# Altium project DC-DC Buck Conv.PrjPcb
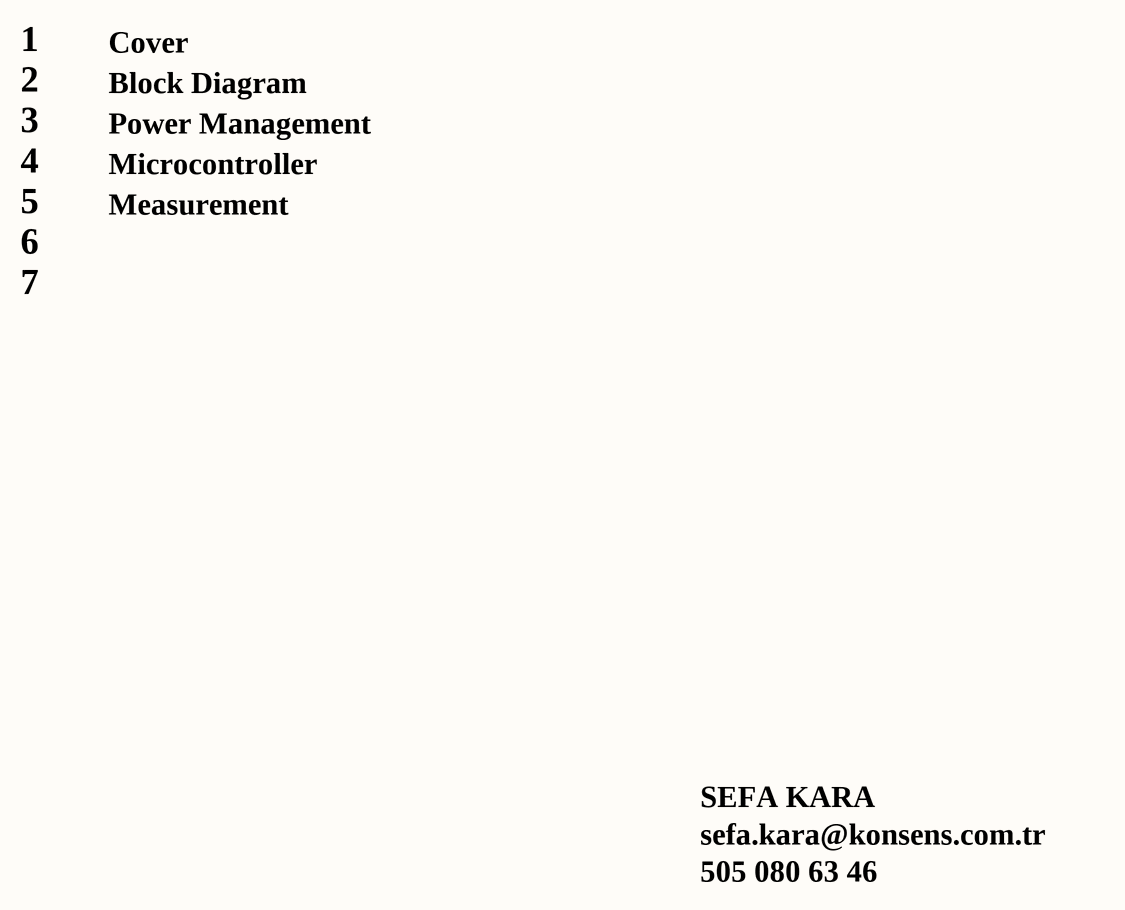
[diagram p0: Cover.SchDoc]
4 sheets, 39 parts. Net scope: global (net labels, ports and power ports of the same name join across sheets).
Board file: DC-DCBuckConv.PcbDoc
Sheets:
  Cover.SchDoc
  BlockDiagram.SchDoc
  Power.SchDoc
  Mcu.SchDoc

## Sheet Cover.SchDoc
size A3; SheetNumber: 1; SheetTotal: 3

### Notes on the sheet
- 1
- 2
- Cover
- Block Diagram
- 3
- Power Management
- 4
- 5
- Microcontroller
- Measurement
- 6
- 7
- SEFA KARA
- sefa.kara@konsens.com.tr
- 505 080 63 46
- CONTENTS
- REVISION
- PRODUCTION NOTES
- Page No
- Description
- Date
- BOARD
- PROPERTIES
- GERBER
- FILES
- APPENDICES
- CONTACT
- Company Name
- Engineer
- PROJECT
- Rel Date
- FILE NAME
- Checked By
- Approved By
- Rev Date
- Change Date
- Department
- Revision
- Sheet
- of

## Sheet BlockDiagram.SchDoc
size A4; SheetNumber: 2; SheetTotal: 5
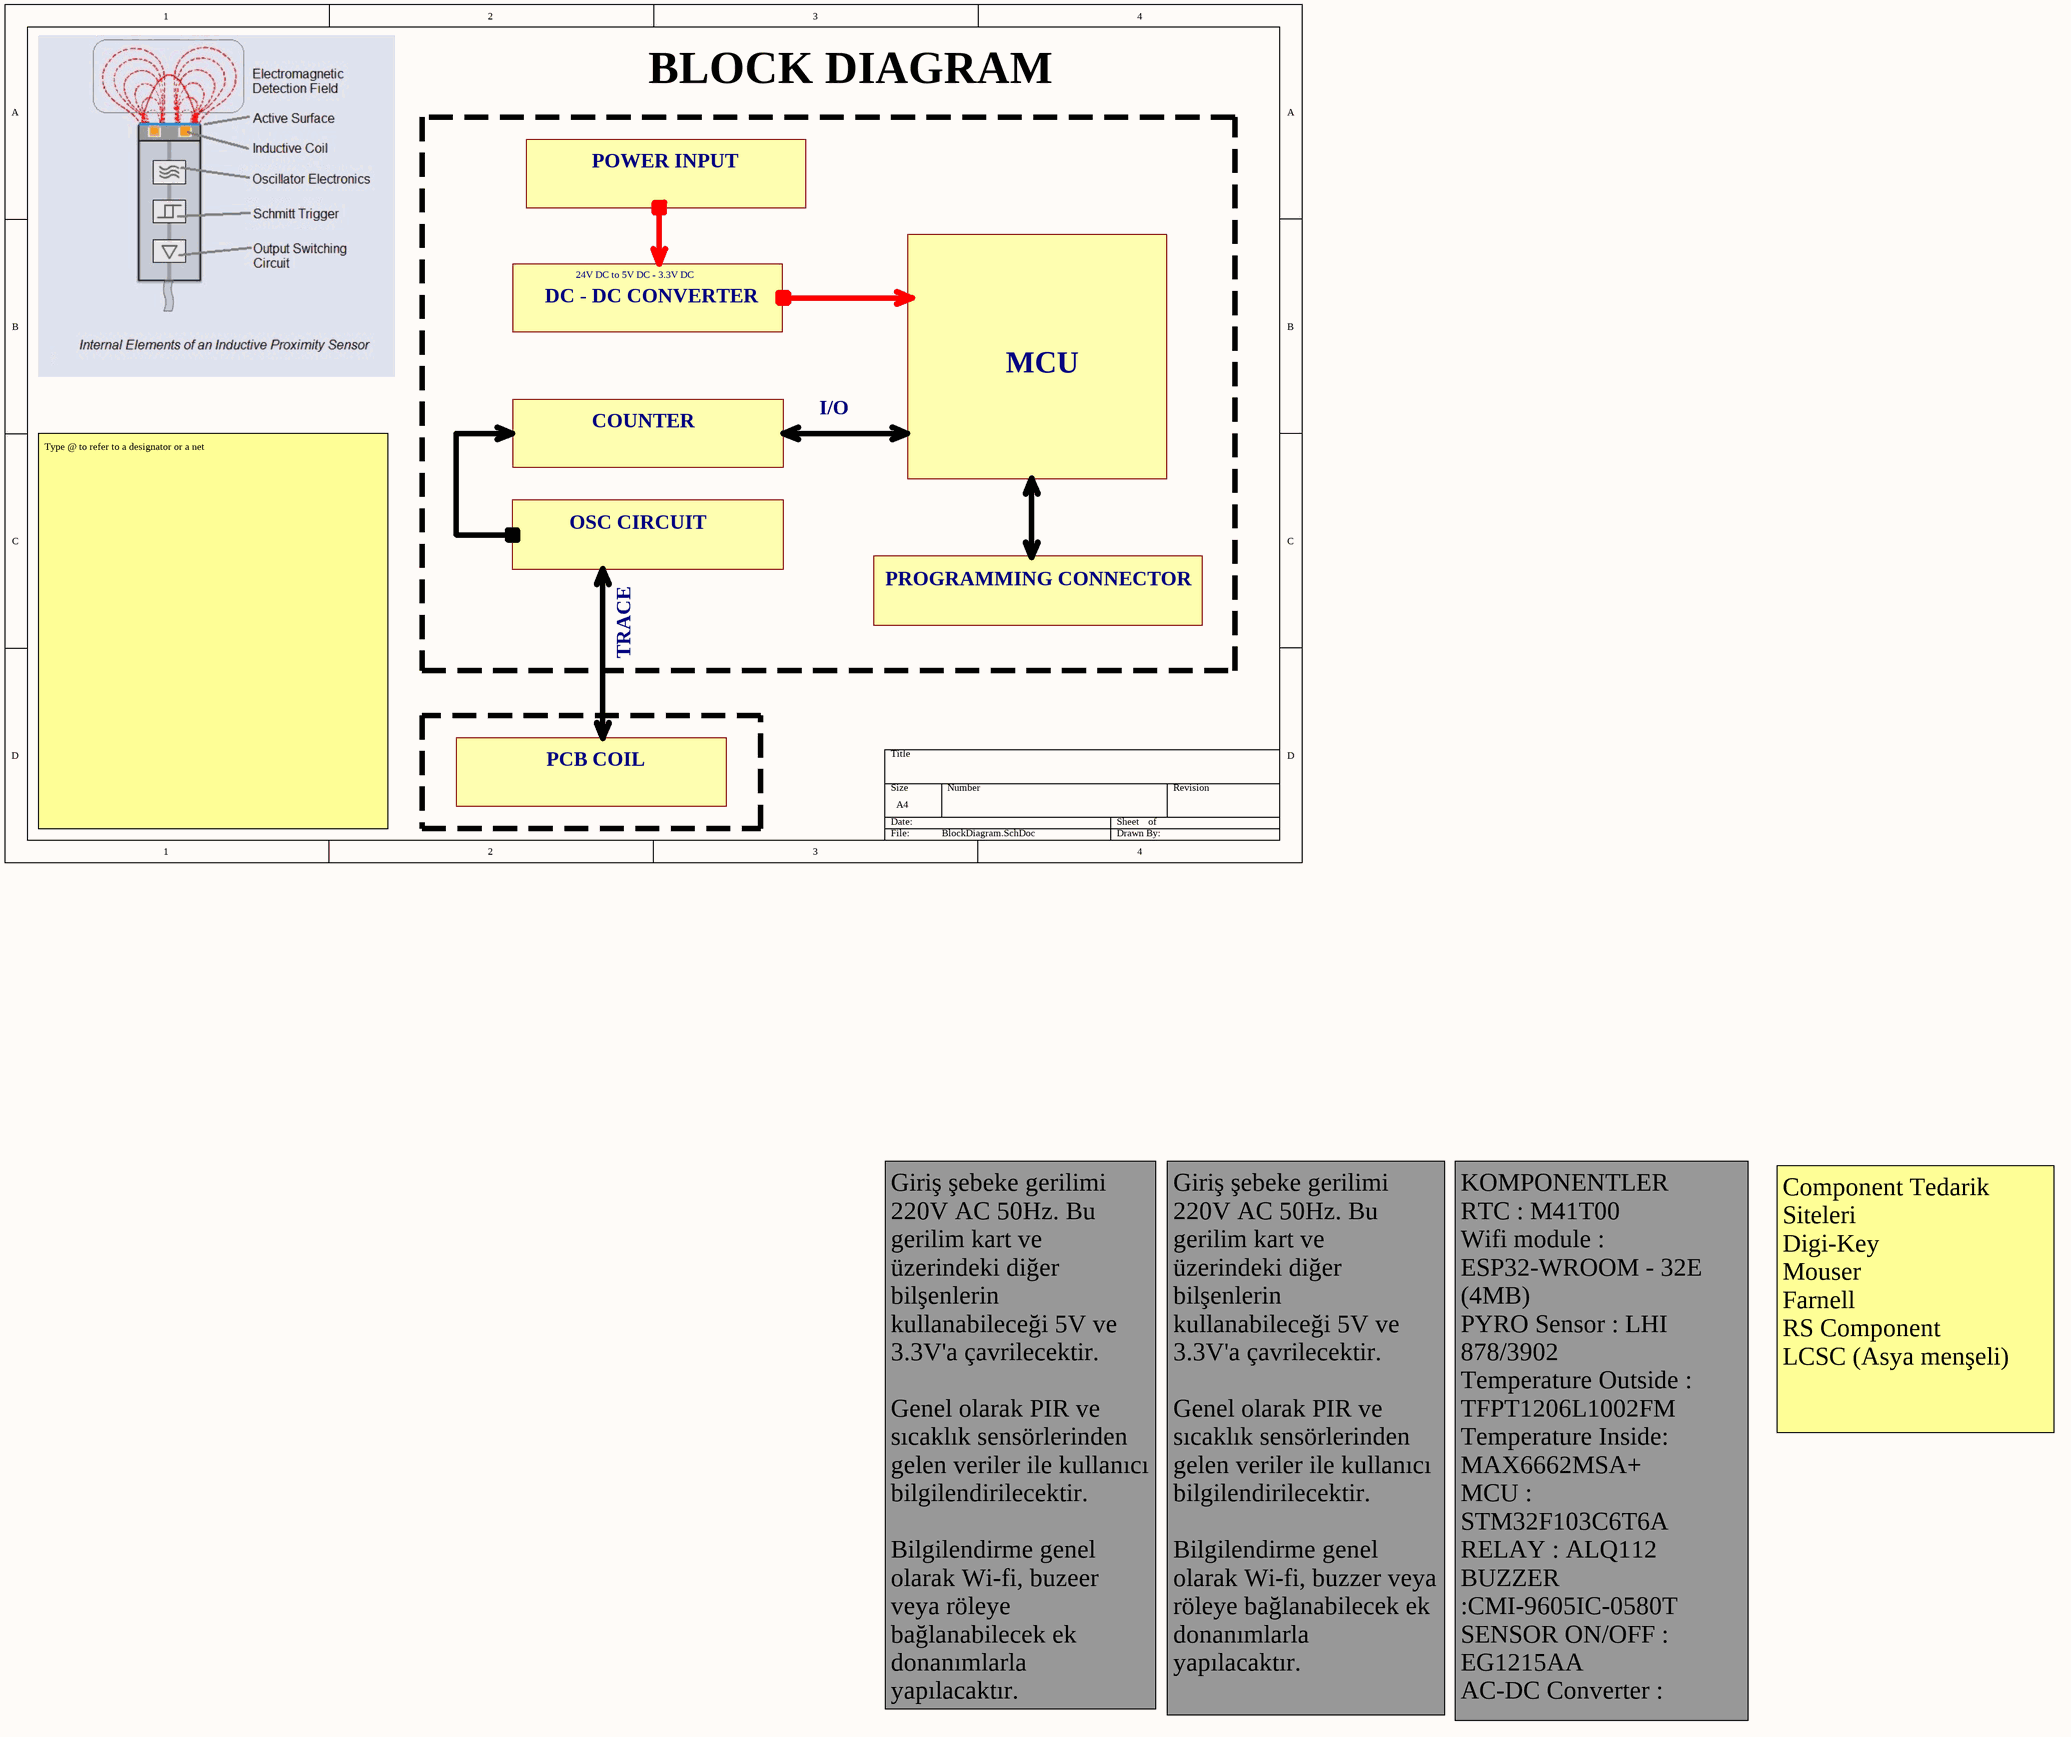
[diagram p1: BlockDiagram.SchDoc]

### Notes on the sheet
- BLOCK DIAGRAM
- POWER INPUT
- DC - DC CONVERTER
- 24V DC to 5V DC - 3.3V DC
- MCU
- COUNTER
- I/O
- OSC CIRCUIT
- PROGRAMMING CONNECTOR
- TRACE
- PCB COIL
- Type @ to refer to a designator or a net
- Component Tedarik Siteleri
  Digi-Key
  Mouser
  Farnell
  RS Component
  LCSC (Asya menşeli)
- Giriş şebeke gerilimi 220V AC 50Hz. Bu gerilim kart ve üzerindeki diğer bilşenlerin kullanabileceği 5V ve 3.3V'a çavrilecektir.
  Genel olarak PIR ve sıcaklık sensörlerinden gelen veriler ile kullanıcı bilgilendirilecektir.
  Bilgilendirme genel olarak Wi-fi, buzeer veya röleye bağlanabilecek ek donanımlarla yapılacaktır.
- Giriş şebeke gerilimi 220V AC 50Hz. Bu gerilim kart ve üzerindeki diğer bilşenlerin kullanabileceği 5V ve 3.3V'a çavrilecektir.
  Genel olarak PIR ve sıcaklık sensörlerinden gelen veriler ile kullanıcı bilgilendirilecektir.
  Bilgilendirme genel olarak Wi-fi, buzzer veya röleye bağlanabilecek ek donanımlarla yapılacaktır.
- KOMPONENTLER
  RTC : M41T00
  Wifi module : ESP32-WROOM - 32E (4MB)
  PYRO Sensor : LHI 878/3902
  Temperature Outside : TFPT1206L1002FM
  Temperature Inside: MAX6662MSA+
  MCU : STM32F103C6T6A
  RELAY : ALQ112
  BUZZER :CMI-9605IC-0580T
  SENSOR ON/OFF : EG1215AA
  AC-DC Converter :
  5VDC LM2675MX-12/NOPB
  3.3VDC AP7361-33E-13
  LED Driver Mosfet : SSM7K357R,LF

## Sheet Power.SchDoc
size A3; SheetNumber: 3; SheetTotal: 5
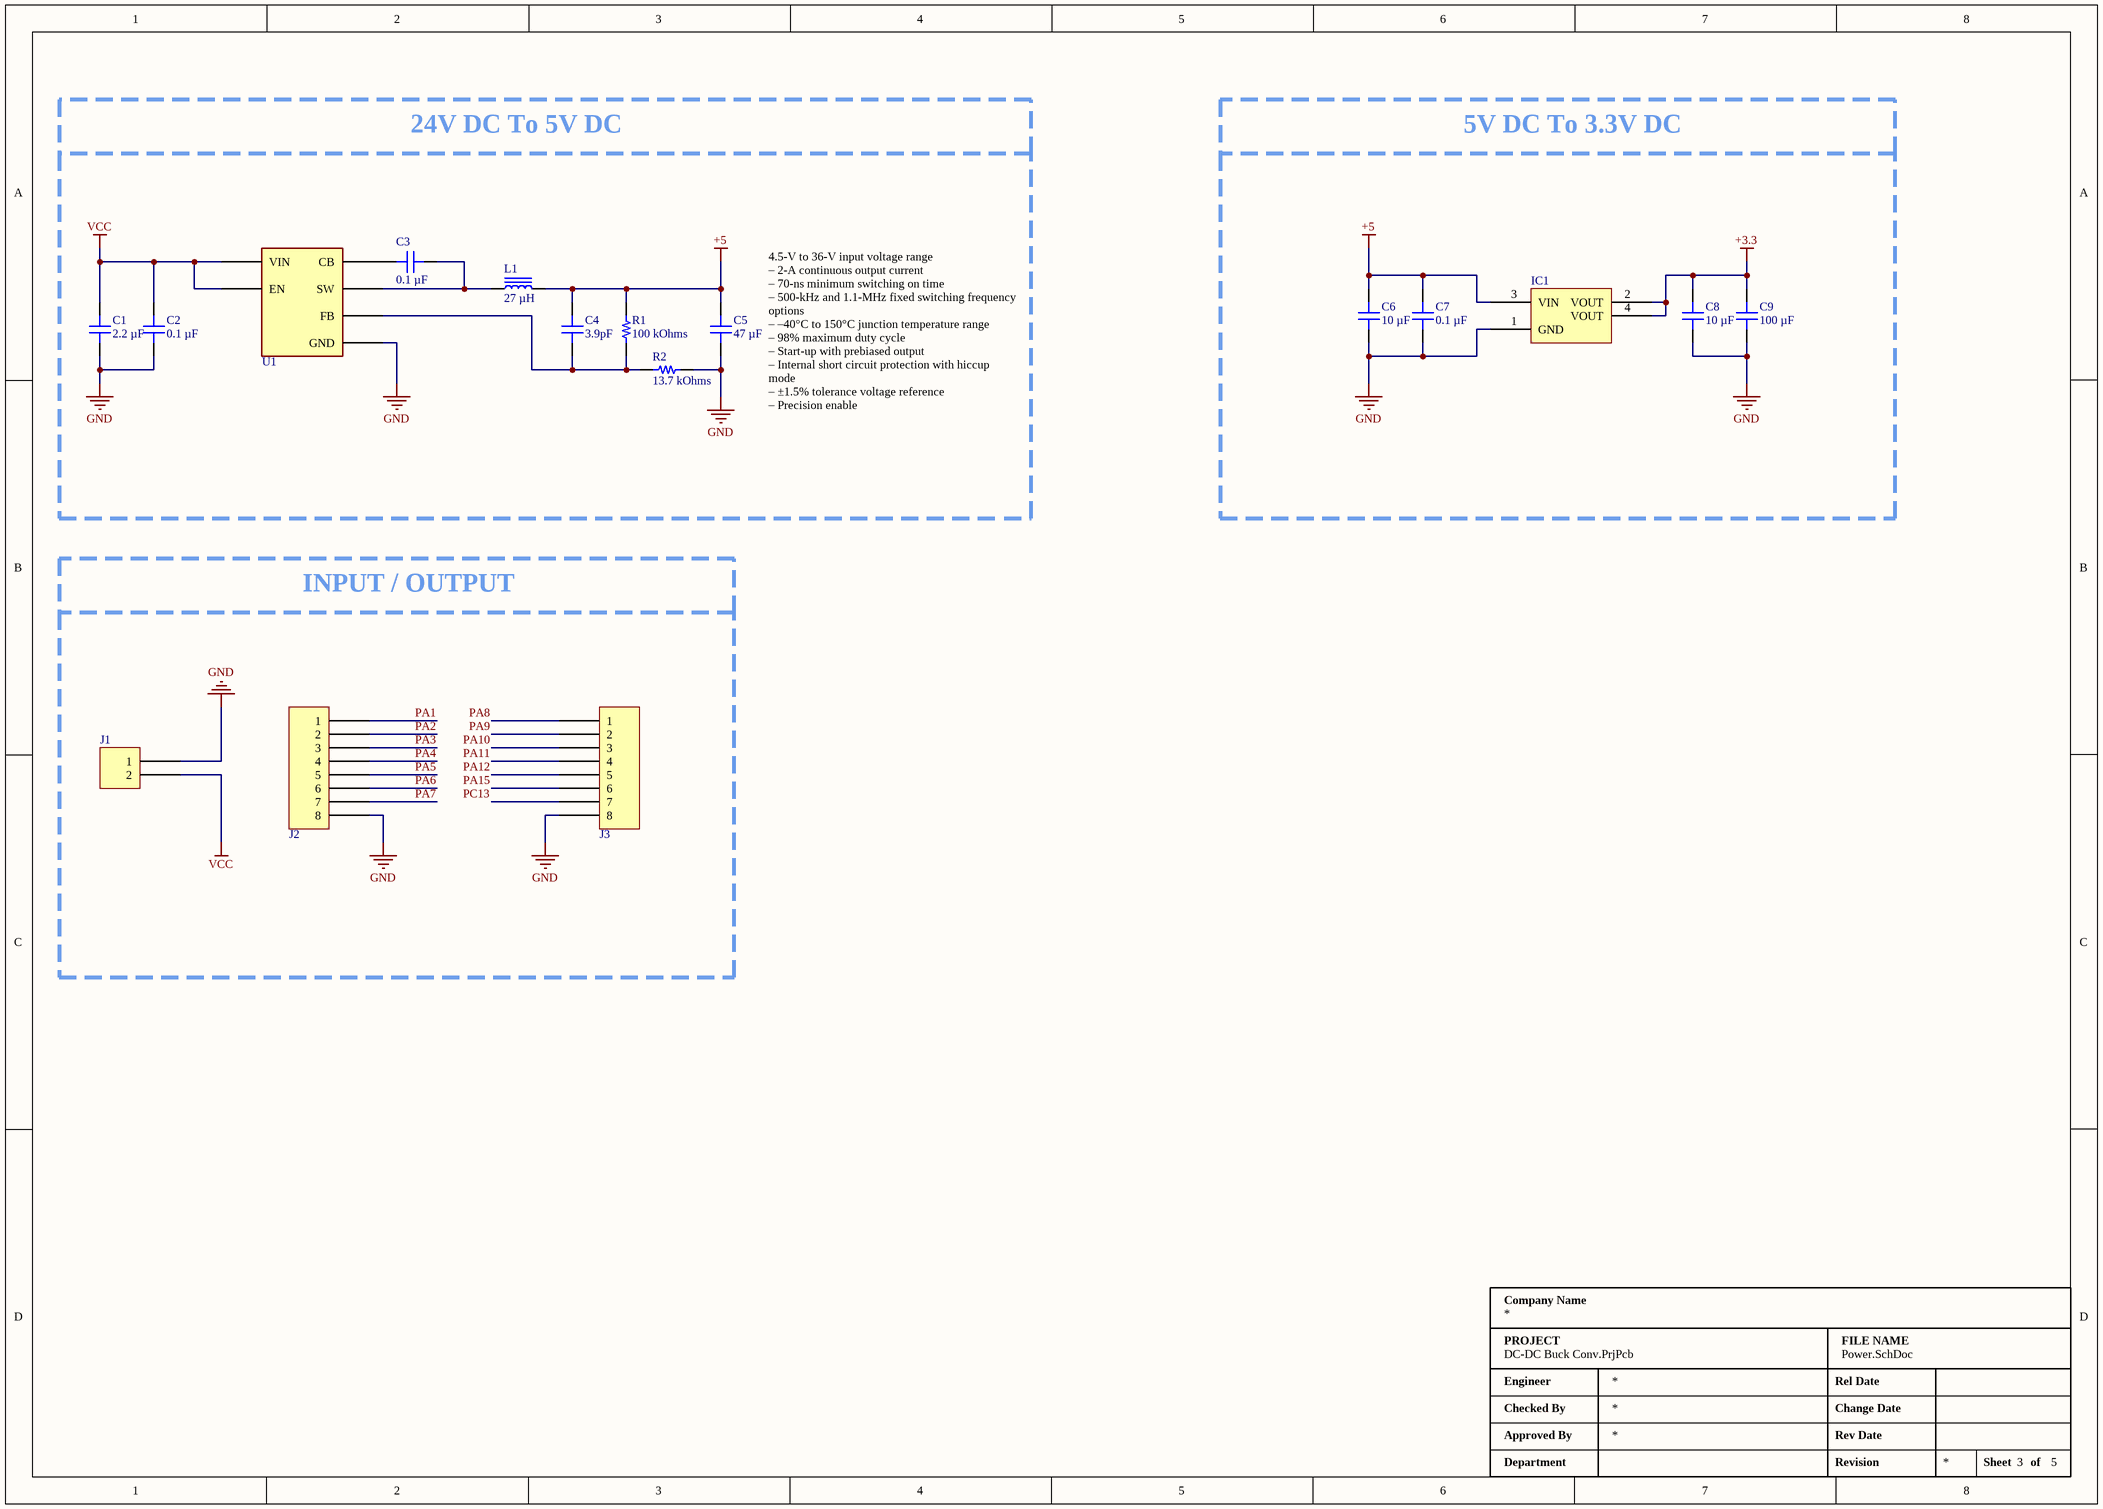
[diagram p2: Power.SchDoc]

### Parts
C1  2.2 µF  [CAP 1206_3216 - 0.8MM]
C2  0.1 µF  [CAP 0603_1608]
C3  0.1 µF  [CAP 0402_1005]
C4  3.9pF  [CAP 0402_1005]
C5  47 µF  [MURATA - GRM32E]
C6  10 µF  [MURATA GRM21B 0805_2012]
C7  0.1 µF  [CAP 0805_2012]
C8  10 µF  [MURATA GRM21B 0805_2012]
C9  100 µF  [MURATA GRM21B 0805_2012]
IC1  LD1117AS33TR  [ST SOT-223]  (value not drawn)
J1  282837-2  [TE 282837-2]  (value not drawn)
J2  SSW-108-03-T-S  [SAMTEC SSW-108-03-T-S]  (value not drawn)
J3  SSW-108-03-T-S  [SAMTEC SSW-108-03-T-S]  (value not drawn)
L1  27 µH  [BOURNS SRR6028]
R1  100 kOhms  [YAGEO RES 0402_1005]
R2  13.7 kOhms  [YAGEO RES 0402_1005]
U1  IC REG BUCK ADJ 2A SOT23  [SOT-23-6 Thin]  (value not drawn)

### Blocks framed on the sheet
5V DC To 3.3V DC: C6-C9 IC1
INPUT / OUTPUT: J1-J3

### Nets
+3.3: C8.2 C9.2 IC1.2(VOUT) IC1.4(VOUT)
+5: C4.1 C5.2 C6.2 C7.2 IC1.3(VIN) L1.2 R1.2
GND: C1.1 C2.1 C5.1 C6.1 C7.1 C8.1 C9.1 IC1.1(GND) J1.1 J2.8 J3.8 R2.2 U1.1(GND)
VCC: C1.2 C2.2 J1.2 U1.3(VIN) U1.5(EN)
PA1: J2.1
PA2: J2.2
PA3: J2.3
PA4: J2.4
PA5: J2.5
PA6: J2.6
PA7: J2.7
PA8: J3.1
PA9: J3.2
PA10: J3.3
PA11: J3.4
PA12: J3.5
PA15: J3.6
PC13: J3.7
NetC3_1: C3.1 L1.1 U1.2(SW)
NetC3_2: C3.2 U1.6(CB)
NetC4_2: C4.2 R1.1 R2.1 U1.4(FB)

### Notes on the sheet
- 24V DC To 5V DC
- (near C5) 4.5-V to 36-V input voltage range
  – 2-A continuous output current
  – 70-ns minimum switching on time
  – 500-kHz and 1.1-MHz fixed switching frequency
  options
  – –40°C to 150°C junction temperature range
  – 98% maximum duty cycle
  – Start-up with prebiased output
  – Internal short circuit protection with hiccup
  mode
  – ±1.5% tolerance voltage reference
  – Precision enable
- Company Name
- Engineer
- PROJECT
- Rel Date
- FILE NAME
- Checked By
- Approved By
- Rev Date
- Change Date
- Department
- Revision
- Sheet
- of

### Library data of the parts
C1 = CL31B225KBHVPNE: CAP CER 2.2UF 50V X7R 1206; manufacturer: Samsung Electro-Mechanics; Tolerance: ±10%; Part Number: CL31B225KBHVPNE; Capacitance: 2.2 µF; Applications: Automotive; componentlink1description: Datasheet; componentlink1url: http://www.samsungsem.com/kr/support/product-search/mlcc/CL31B225KBHVPNE.jsp; componentlink2description: DigiKey Link; componentlink2url: https://www.digikey.com/en/products/detail/samsung-electro-mechanics/CL31B225KBHVPNE/5961219; Device Package: 1206 (3216 Metric); lastupdated: 4.06.2024 19:10:40; Lifecycle Status: Active; Minimum Order: 1; Mounting Type: Surface Mount, MLCC; Operating Temperature: -55°C ~ 125°C; Package / Case: 1206 (3216 Metric); packaging: TapeAndReel; partid: 20106; Part Status: Active; price: 0.05; Ratings: AEC-Q200; series: CL; Size / Dimension: 0.126" L x 0.063" W (3.20mm x 1.60mm); Supplier 1: DigiKey; Supplier Part Number 1: 1276-6735-1-ND; Temperature Coefficient: X7R; Thickness (Max): 0.071" (1.80mm); value: 2.2 µF; Voltage - Rated: 50V
C2 = C0603X104K5RAC3316: CAP CER 0603 0.1UF 50V X7R 10%; manufacturer: KEMET; Part Number: C0603X104K5RAC3316; Capacitance: 0.1 µF; Applications: Automotive, Boardflex Sensitive; componentlink1description: Datasheet; componentlink1url: https://api.kemet.com/component-edge/download/datasheet/C0603X104K5RAC3316.pdf; componentlink2description: DigiKey Link; componentlink2url: https://www.digikey.com/en/products/detail/kemet/C0603X104K5RAC3316/10315788; Device Package: 0603 (1608 Metric); Features: Soft Termination; lastupdated: 9.02.2024 20:10:19; Lifecycle Status: Active; Minimum Order: 1; Mounting Type: Surface Mount, MLCC; Operating Temperature: -55°C ~ 125°C; Package / Case: 0603 (1608 Metric); packaging: TapeAndReel; partid: 11116; Part Status: Active; price: 0.02; Ratings: AEC-Q200; series: SMD Auto X7R VW80808; Size / Dimension: 0.063" L x 0.031" W (1.60mm x 0.80mm); Supplier 1: DigiKey; Supplier Part Number 1: 399-C0603X104K5RAC3316CT-ND; Temperature Coefficient: X7R; Thickness (Max): 0.037" (0.95mm); Tolerance: ±10%; value: 0.1 µF; Voltage - Rated: 50V
C3 = C0402C104K4RECAUTO: CAP CER 0402 0.1UF 16V X7R 10%; manufacturer: KEMET; Part Number: C0402C104K4RECAUTO; Capacitance: 0.1 µF; Applications: Automotive, ESD Protection; componentlink1description: Datasheet; componentlink1url: https://api.kemet.com/component-edge/download/datasheet/C0402C104K4RECAUTO.pdf; componentlink2description: DigiKey Link; componentlink2url: https://www.digikey.com/en/products/detail/kemet/C0402C104K4RECAUTO/8563695; Device Package: 0402 (1005 Metric); lastupdated: 9.02.2024 20:04:38; Lifecycle Status: Active; Minimum Order: 1; Mounting Type: Surface Mount, MLCC; Operating Temperature: -55°C ~ 125°C; Package / Case: 0402 (1005 Metric); packaging: TapeAndReel; partid: 1731; Part Status: Active; price: 0.01; Ratings: AEC-Q200; series: ESD SMD Auto X7R; Size / Dimension: 0.039" L x 0.020" W (1.00mm x 0.50mm); Supplier 1: DigiKey; Supplier Part Number 1: 399-17167-1-ND; Temperature Coefficient: X7R; Thickness (Max): 0.022" (0.55mm); Tolerance: ±10%; value: 0.1 µF; Voltage - Rated: 16V
C4 = 04023U3R9BAT2A: CAP CER 3.9PF 25V NP0 0402; manufacturer: AVX Corporation; Temperature Coefficient: C0G, NP0; Tolerance: ±0.1pF; Part Number: 04023U3R9BAT2A; Capacitance: 3.9pF; Applications: RF, Microwave, High Frequency; componentlink1description: Datasheet; componentlink1url: http://datasheets.avx.com/U-Series.pdf; componentlink2description: DigiKey Link; componentlink2url: http://digikey.com/product-detail/en/avx-corporation/04023U3R9BAT2A/478-11759-1-ND/8573395; Device Package: 0402 (1005 Metric); Features: Ultra Low ESR; lastupdated: 8.02.2022 12:26:42; Lifecycle Status: Active; Minimum Order: 1; Mounting Type: Surface Mount, MLCC; Operating Temperature: -55°C ~ 125°C; Package / Case: 0402 (1005 Metric); packaging: TapeAndReel; partid: 11132; Part Status: Active; price: 0.03; series: U; Size / Dimension: 0.039" L x 0.020" W (1.00mm x 0.50mm); Supplier 1: DigiKey; Supplier Part Number 1: 478-11759-1-ND; Thickness (Max): 0.022" (0.55mm); value: 3.9pF; Voltage - Rated: 25V
C5 = GRM32EC81C476KE15L: CAP CER 47UF 16V X6S 1210; manufacturer: Murata Electronics; Tolerance: ±10%; Part Number: GRM32EC81C476KE15L; Value: 47 µF; Applications: General Purpose; Capacitance: 47 µF; componentlink1description: Datasheet; componentlink1url: https://search.murata.co.jp/Ceramy/image/img/A01X/G101/ENG/GRM32EC81C476KE15-01.pdf; componentlink2description: DigiKey Link; componentlink2url: https://www.digikey.com/en/products/detail/murata-electronics/GRM32EC81C476KE15L/5027615; Device Package: 1210 (3225 Metric); lastupdated: 27.08.2024 14:53:22; Lifecycle Status: Active; Minimum Order: 1; Mounting Type: Surface Mount, MLCC; Operating Temperature: -55°C ~ 105°C; Package / Case: 1210 (3225 Metric); packaging: TapeAndReel; partid: 23627; Part Status: Active; price: 0.12; series: GRM; Size / Dimension: 0.126" L x 0.098" W (3.20mm x 2.50mm); Supplier 1: DigiKey; Supplier Part Number 1: 490-10531-1-ND; Temperature Coefficient: X6S; Thickness (Max): 0.106" (2.70mm); Voltage - Rated: 16V
C6 C8 = GRM21BR61H106KE43L: CAP CER 10UF 50V X5R 0805; manufacturer: Murata Electronics; Tolerance: ±10%; Part Number: GRM21BR61H106KE43L; Capacitance: 10 µF; Applications: Mobile Devices Only; componentlink1description: Datasheet; componentlink1url: https://search.murata.co.jp/Ceramy/image/img/A01X/G101/ENG/GRM21BR61H106KE43-01A.pdf; componentlink2description: DigiKey Link; componentlink2url: https://www.digikey.com/en/products/detail/murata-electronics/GRM21BR61H106KE43L/10326316; Device Package: 0805 (2012 Metric); lastupdated: 27.08.2024 09:29:56; Lifecycle Status: Active; Minimum Order: 1; Mounting Type: Surface Mount, MLCC; Operating Temperature: -55°C ~ 85°C; Package / Case: 0805 (2012 Metric); packaging: TapeAndReel; partid: 39284; Part Status: Active; price: 0.05; series: GRM; Size / Dimension: 0.079" L x 0.049" W (2.00mm x 1.25mm); Supplier 1: DigiKey; Supplier Part Number 1: 490-18663-1-ND; Temperature Coefficient: X5R; Thickness (Max): 0.057" (1.45mm); value: 10 µF; Voltage - Rated: 50V
C7 = C0805C104J1RECAUTO: CAP CER 0805 0.1UF 100V X7R 5%; manufacturer: KEMET; Part Number: C0805C104J1RECAUTO; Capacitance: 0.1 µF; Applications: Automotive, ESD Protection; componentlink1description: Datasheet; componentlink1url: https://api.kemet.com/component-edge/download/datasheet/C0805C104J1RECAUTO.pdf; componentlink2description: DigiKey Link; componentlink2url: https://www.digikey.com/en/products/detail/kemet/C0805C104J1RECAUTO/8646637; Device Package: 0805 (2012 Metric); lastupdated: 9.02.2024 20:15:06; Lifecycle Status: Active; Minimum Order: 1; Mounting Type: Surface Mount, MLCC; Operating Temperature: -55°C ~ 125°C; Package / Case: 0805 (2012 Metric); packaging: TapeAndReel; partid: 31979; Part Status: Active; price: 0.05; Ratings: AEC-Q200; series: ESD SMD Auto X7R; Size / Dimension: 0.079" L x 0.049" W (2.00mm x 1.25mm); Supplier 1: DigiKey; Supplier Part Number 1: 399-C0805C104J1RECAUTOCT-ND; Temperature Coefficient: X7R; Thickness (Max): 0.043" (1.10mm); Tolerance: ±5%; value: 0.1 µF; Voltage - Rated: 100V
C9 = GRM21BR60J107ME15K: CAP CER 100UF 6.3V X5R 0805; manufacturer: Murata Electronics; Tolerance: ±20%; Part Number: GRM21BR60J107ME15K; Capacitance: 100 µF; Applications: General Purpose; componentlink1description: Datasheet; componentlink1url: https://search.murata.co.jp/Ceramy/image/img/A01X/G101/ENG/GRM21BR60J107ME15-01A.pdf; componentlink2description: DigiKey Link; componentlink2url: https://www.digikey.com/en/products/detail/murata-electronics/GRM21BR60J107ME15K/9887675; Device Package: 0805 (2012 Metric); lastupdated: 27.08.2024 09:29:54; Lifecycle Status: Active; Minimum Order: 1; Mounting Type: Surface Mount, MLCC; Operating Temperature: -55°C ~ 85°C; Package / Case: 0805 (2012 Metric); packaging: TapeAndReel; partid: 39832; Part Status: Active; price: 0.39; series: GRM; Size / Dimension: 0.079" L x 0.049" W (2.00mm x 1.25mm); Supplier 1: DigiKey; Supplier Part Number 1: 490-GRM21BR60J107ME15KCT-ND; Temperature Coefficient: X5R; Thickness (Max): 0.057" (1.45mm); value: 100 µF; Voltage - Rated: 6.3V
IC1 = LD1117AS33TR: IC REG LINEAR 3.3V 1A SOT223; Manufacturer: STMicroelectronics; Current - Quiescent (Iq): 10 mA; Number of Regulators: 1; Output Configuration: Positive; Output Type: Fixed; Protection Features: Over Current, Over Temperature; PSRR: 75dB (120Hz); Voltage Dropout (Max): 1.3V @ 1A; Voltage - Input (Max): 15V; Part Number: LD1117AS33TR; ComponentLink1Description: Datasheet; ComponentLink1URL: http://www.st.com/content/ccc/resource/technical/document/datasheet/a5/c3/3f/c9/2b/15/40/49/CD00002116.pdf/files/CD00002116.pdf/jcr:content/translations/en.CD00002116.pdf; ComponentLink2Description: DigiKey Link; ComponentLink2URL: https://www.digikey.com/en/products/detail/stmicroelectronics/LD1117AS33TR/585752; Current - Output: 1A; LastUpdated: 3.06.2024 20:14:21; Lifecycle Status: Active; Minimum Order: 1; Mounting Type: Surface Mount; Operating Temperature: 0°C ~ 125°C; Package / Case: TO-261-4, TO-261AA; Packaging: TapeAndReel; Part Status: Active; Price: 0.32; Series: -; Supplier 1: DigiKey; Supplier Part Number 1: 497-1228-1-ND; Supplier Device Package: SOT-223; Voltage - Output (Min/Fixed): 3.3V
J1 = 282837-2: TERM BLK 2P SIDE ENT 5.08MM PCB; Manufacturer: TE Connectivity AMP Connectors; Current: 13.5 A; Mating Orientation: Horizontal with Board; Number of Levels: 1; Pitch: 0.200" (5.08mm); Positions Per Level: 2; Voltage: 300 V; Wire Gauge: 16-28 AWG; Wire Termination: Screw - Rising Cage Clamp; Part Number: 282837-2; Color: Green; ComponentLink1Description: Datasheet; ComponentLink1URL: https://www.te.com/commerce/DocumentDelivery/DDEController?Action=srchrtrv&DocNm=282837&DocType=Customer+Drawing&DocLang=English; ComponentLink2Description: DigiKey Link; ComponentLink2URL: https://www.digikey.com/en/products/detail/te-connectivity-amp-connectors/282837-2/2187973; Features: Interlocking (Side); LastUpdated: 21.06.2022 15:00:23; Lifecycle Status: Active; Minimum Order: 1; Mounting Type: Through Hole; Packaging: Tray; Part Status: Active; Price: 0.31; Series: Buchanan; Supplier 1: DigiKey; Supplier Part Number 1: A113320-ND
J2 J3 = SSW-108-03-T-S: CONN RCPT 8POS 0.1 TIN PCB; Manufacturer: Samtec Inc.; Connector Type: Receptacle; Contact Length - Post: 0.394" (10.00mm); Current Rating (Amps): 5.7A per Contact; Material Flammability Rating: UL94 V-0; Number of Positions: 8; Number of Positions Loaded: All; Pitch - Mating: 0.100" (2.54mm); Style: Board to Board or Cable; Part Number: SSW-108-03-T-S; ComponentLink1Description: Datasheet; ComponentLink1URL: http://suddendocs.samtec.com/catalog_english/ssw_th.pdf; ComponentLink2Description: DigiKey Link; ComponentLink2URL: https://www.digikey.com/en/products/detail/samtec-inc/SSW-108-03-T-S/1790200; Contact Finish - Mating: Tin; Contact Finish - Post: Tin; Contact Type: Forked; Fastening Type: Push-Pull; Insulation Color: Black; Insulation Height: 0.335" (8.51mm); LastUpdated: 21.06.2022 15:09:52; Lifecycle Status: Active; Minimum Order: 1; Mounting Type: Through Hole; Number of Rows: 1; Operating Temperature: -55°C ~ 105°C; Packaging: Bulk; Part Status: Active; Price: 0.73; Series: SSW; Supplier 1: DigiKey; Supplier Part Number 1: SAM8866-ND; Termination: Solder
L1 = SRR6028-270Y: FIXED IND 27UH 1.2A 130 MOHM SMD; Manufacturer: Bourns Inc.; Current - Saturation: 1A; DC Resistance (DCR): 130mOhm Max; Frequency - Self Resonant: 19MHz; Inductance Frequency - Test: 100 kHz; Material - Core: Ferrite; Q @ Freq: 9 @ 2.52MHz; Shielding: Shielded; Tolerance: ±30%; Type: Drum Core, Wirewound; Part Number: SRR6028-270Y; ComponentLink1Description: Datasheet; ComponentLink1URL: https://www.bourns.com/docs/Product-Datasheets/SRR6028.pdf; ComponentLink2Description: DigiKey Link; ComponentLink2URL: https://www.digikey.com/en/products/detail/bourns-inc/SRR6028-270Y/1970380; Current Rating (Amps): 1.2 A; Device Package: Nonstandard; Height - Seated (Max): 0.118" (3.00mm); Inductance: 27 µH; LastUpdated: 3.06.2024 20:02:38; Lifecycle Status: Active; Minimum Order: 1; Mounting Type: Surface Mount; Operating Temperature: -40°C ~ 125°C; Package / Case: Nonstandard; Packaging: TapeAndReel; PartId: 53; Part Status: Active; Price: 0.31; Series: SRR6028; Size / Dimension: 0.268" L x 0.268" W (6.80mm x 6.80mm); Supplier 1: DigiKey; Supplier Part Number 1: 118-SRR6028-270YCT-ND; Value: 27 µH
R1 = RC0402FR-07162KL: RES 162K OHM 1% 1/16W 0402; Manufacturer: Yageo; Power (Watts): 0.063W, 1/16W; Temperature Coefficient: ±100ppm/°C; Part Number: RC0402FR-07162KL; Value: 100 kOhms; ComponentLink1Description: Datasheet; ComponentLink1URL: https://www.yageo.com/upload/media/product/productsearch/datasheet/rchip/PYu-RC_Group_51_RoHS_L_10.pdf; ComponentLink2Description: DigiKey Link; ComponentLink2URL: https://www.digikey.com/en/products/detail/yageo/RC0402FR-07162KL/2345133; Composition: Thick Film; Device Package: 0402 (1005 Metric); Features: Moisture Resistant; Height - Seated (Max): 0.016" (0.40mm); LastUpdated: 25.07.2024 09:18:19; Lifecycle Status: Active; Minimum Order: 1; Number of Terminations: 2; Operating Temperature: -55°C ~ 155°C; Package / Case: 0402 (1005 Metric); Packaging: CutTape; PartId: 2536; Part Status: Active; Price: 0.01; Resistance: 100 kOhms; Series: RC_L; Size / Dimension: 0.039" L x 0.020" W (1.00mm x 0.50mm); Supplier 1: DigiKey; Supplier Part Number 1: YAG2370CT-ND; Supplier Device Package: 0402; Tolerance: ±1%
R2 = RC0402FR-0722K1L: RES 22.1K OHM 1% 1/16W 0402; Manufacturer: Yageo; Power (Watts): 0.063W, 1/16W; Temperature Coefficient: ±100ppm/°C; Part Number: RC0402FR-0722K1L; Value: 13.7 kOhms; ComponentLink1Description: Datasheet; ComponentLink1URL: https://www.yageo.com/upload/media/product/productsearch/datasheet/rchip/PYu-RC_Group_51_RoHS_L_10.pdf; ComponentLink2Description: DigiKey Link; ComponentLink2URL: https://www.digikey.com/en/products/detail/yageo/RC0402FR-0722K1L/726563; Composition: Thick Film; Device Package: 0402 (1005 Metric); Features: Moisture Resistant; Height - Seated (Max): 0.016" (0.40mm); LastUpdated: 25.07.2024 09:18:19; Lifecycle Status: Active; Minimum Order: 1; Number of Terminations: 2; Operating Temperature: -55°C ~ 155°C; Package / Case: 0402 (1005 Metric); Packaging: CutTape; PartId: 2641; Part Status: Active; Price: 0.01; Resistance: 13.7 kOhms; Series: RC_L; Size / Dimension: 0.039" L x 0.020" W (1.00mm x 0.50mm); Supplier 1: DigiKey; Supplier Part Number 1: 311-22.1KLRCT-ND; Supplier Device Package: 0402; Tolerance: ±1%
U1 = LMR51420XDDCR: IC REG BUCK ADJ 2A SOT23-THIN "Buck Switching Regulator IC Positive Adjustable 0.6V 1 Output 2A SOT-23-6 Thin,...

## Sheet Mcu.SchDoc
size A3; SheetNumber: 4; SheetTotal: 5
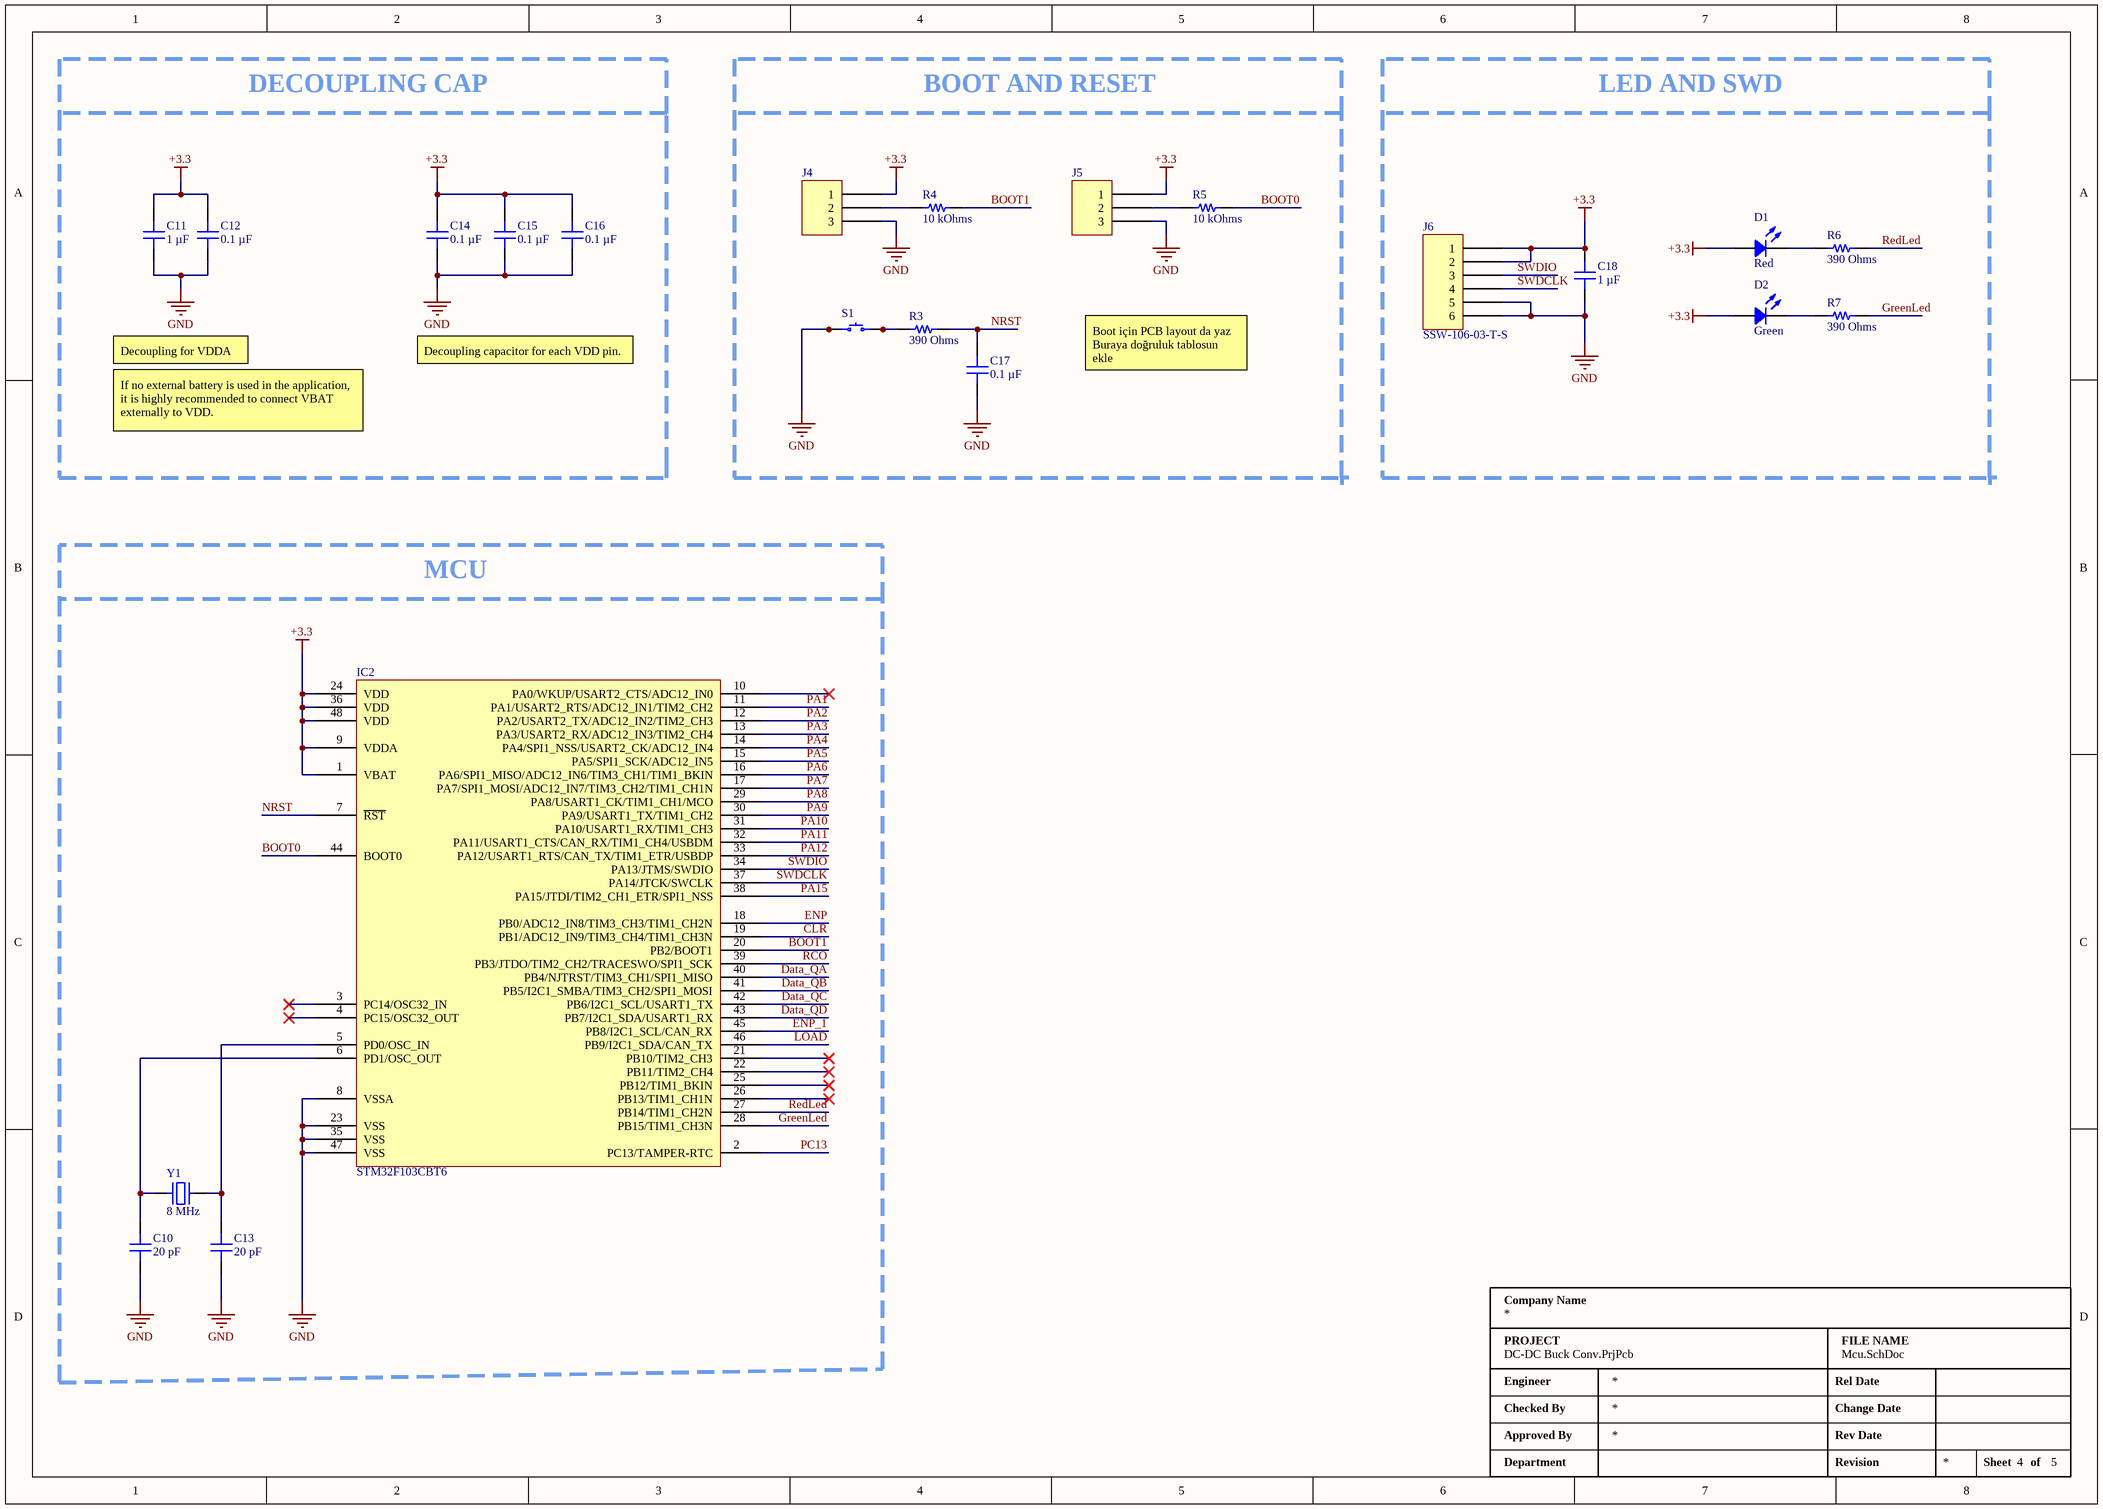
[diagram p3: Mcu.SchDoc]

### Parts
C10  20 pF  [CAP 0805_2012]
C11  1 µF  [CAP 0603_1608]
C12  0.1 µF  [CAP 0805_2012]
C13  20 pF  [CAP 0805_2012]
C14  0.1 µF  [CAP 0805_2012]
C15  0.1 µF  [CAP 0805_2012]
C16  0.1 µF  [CAP 0805_2012]
C17  0.1 µF  [CAP 0805_2012]
C18  1 µF  [CAP 0603_1608]
D1  Red  [LED 0805_2012 RED]
D2  Green  [LED 0805_2012 RED]
IC2  STM32F103CBT6  [ST LQFP-48 7X7MM]
J4  61300311121  [WURTH WE-PHD 61300311121]  (value not drawn)
J5  61300311121  [WURTH WE-PHD 61300311121]  (value not drawn)
J6  SSW-106-03-T-S  [SAMTEC SSW-106-03-T-S]
R3  390 Ohms  [KOA RES RK73 RN73 0603_1608]
R4  10 kOhms  [YAGEO RES 0603_1608]
R5  10 kOhms  [YAGEO RES 0603_1608]
R6  390 Ohms  [KOA RES RK73 RN73 0603_1608]
R7  390 Ohms  [KOA RES RK73 RN73 0603_1608]
S1  PTS645SM43SMTR92 LFS  [C&K PTS645]  (value not drawn)
Y1  8 MHz  [NDK NX5032GA]

### Blocks framed on the sheet
DECOUPLING CAP: C11 C12 C14-C16
MCU: C10 C13 IC2 Y1

### Nets
+3.3: C11.2 C12.2 C14.2 C15.2 C16.2 C18.2 D1.1 D2.1 IC2.1(VBAT) IC2.9(VDDA) IC2.24(VDD) IC2.36(VDD) IC2.48(VDD) J4.1 J5.1 J6.1 J6.2
GND: C10.1 C11.1 C12.1 C13.1 C14.1 C15.1 C16.1 C17.2 C18.1 IC2.8(VSSA) IC2.23(VSS) IC2.35(VSS) IC2.47(VSS) J4.3 J5.3 J6.5 J6.6 S1.1 S1.2
BOOT0: IC2.44(BOOT0) R5.2
BOOT1: IC2.20(PB2/BOOT1) R4.2
CLR: IC2.19(PB1/ADC12_IN9/TIM3_CH4/TIM1_CH3N)
Data_QA: IC2.40(PB4/NJTRST/TIM3_CH1/SPI1_MISO)
Data_QB: IC2.41(PB5/I2C1_SMBA/TIM3_CH2/SPI1_MOSI)
Data_QC: IC2.42(PB6/I2C1_SCL/USART1_TX)
Data_QD: IC2.43(PB7/I2C1_SDA/USART1_RX)
ENP: IC2.18(PB0/ADC12_IN8/TIM3_CH3/TIM1_CH2N)
ENP_1: IC2.45(PB8/I2C1_SCL/CAN_RX)
GreenLed: IC2.28(PB15/TIM1_CH3N) R7.1
LOAD: IC2.46(PB9/I2C1_SDA/CAN_TX)
NRST: C17.1 IC2.7(~{RST}) R3.2
PA1: IC2.11(PA1/USART2_RTS/ADC12_IN1/TIM2_CH2)
PA2: IC2.12(PA2/USART2_TX/ADC12_IN2/TIM2_CH3)
PA3: IC2.13(PA3/USART2_RX/ADC12_IN3/TIM2_CH4)
PA4: IC2.14(PA4/SPI1_NSS/USART2_CK/ADC12_IN4)
PA5: IC2.15(PA5/SPI1_SCK/ADC12_IN5)
PA6: IC2.16(PA6/SPI1_MISO/ADC12_IN6/TIM3_CH1/TIM1_BKIN)
PA7: IC2.17(PA7/SPI1_MOSI/ADC12_IN7/TIM3_CH2/TIM1_CH1N)
PA8: IC2.29(PA8/USART1_CK/TIM1_CH1/MCO)
PA9: IC2.30(PA9/USART1_TX/TIM1_CH2)
PA10: IC2.31(PA10/USART1_RX/TIM1_CH3)
PA11: IC2.32(PA11/USART1_CTS/CAN_RX/TIM1_CH4/USBDM)
PA12: IC2.33(PA12/USART1_RTS/CAN_TX/TIM1_ETR/USBDP)
PA15: IC2.38(PA15/JTDI/TIM2_CH1_ETR/SPI1_NSS)
PC13: IC2.2(PC13/TAMPER-RTC)
RCO: IC2.39(PB3/JTDO/TIM2_CH2/TRACESWO/SPI1_SCK)
RedLed: IC2.27(PB14/TIM1_CH2N) R6.1
SWDCLK: IC2.37(PA14/JTCK/SWCLK) J6.4
SWDIO: IC2.34(PA13/JTMS/SWDIO) J6.3
NetC10_2: C10.2 IC2.6(PD1/OSC_OUT) Y1.2
NetC13_2: C13.2 IC2.5(PD0/OSC_IN) Y1.1
NetD1_2: D1.2 R6.2
NetD2_2: D2.2 R7.2
NetJ4_2: J4.2 R4.1
NetJ5_2: J5.2 R5.1
NetR3_1: R3.1 S1.3 S1.4

Not connected (* = marked no-connect by the designer): IC2 3(PC14/OSC32_IN)* 4(PC15/OSC32_OUT)* 10(PA0/WKUP/USART2_CTS/ADC12_IN0)* 21(PB10/TIM2_CH3)* 22(PB11/TIM2_CH4)* 25(PB12/TIM1_BKIN)* 26(PB13/TIM1_CH1N)*

### Notes on the sheet
- BOOT AND RESET
- LED AND SWD
- Decoupling for VDDA
- Decoupling capacitor for each VDD pin.
- Boot için PCB layout da yaz
  Buraya doğruluk tablosun ekle
- If no external battery is used in the application, it is highly recommended to connect VBAT
  externally to VDD.
- Company Name
- Engineer
- PROJECT
- Rel Date
- FILE NAME
- Checked By
- Approved By
- Rev Date
- Change Date
- Department
- Revision
- Sheet
- of

### Library data of the parts
C10 C13 = C0805C200F5GAC7800: CAP CER SMD 0805 20PF 50V 1% COG; manufacturer: KEMET; Temperature Coefficient: C0G, NP0; Part Number: C0805C200F5GAC7800; Capacitance: 20 pF; Applications: General Purpose; componentlink1description: Datasheet; componentlink1url: https://api.kemet.com/component-edge/download/datasheet/C0805C200F5GAC7800.pdf; componentlink2description: DigiKey Link; componentlink2url: https://www.digikey.com/en/products/detail/kemet/C0805C200F5GAC7800/8572458; Device Package: 0805 (2012 Metric); Features: Low ESL; lastupdated: 9.02.2024 20:15:38; Lifecycle Status: Active; Minimum Order: 1; Mounting Type: Surface Mount, MLCC; Operating Temperature: -55°C ~ 125°C; Package / Case: 0805 (2012 Metric); packaging: TapeAndReel; partid: 13880; Part Status: Active; price: 0.32; series: SMD Comm C0G; Size / Dimension: 0.079" L x 0.049" W (2.00mm x 1.25mm); Supplier 1: DigiKey; Supplier Part Number 1: 399-17623-1-ND; Thickness (Max): 0.035" (0.88mm); Tolerance: ±1%; value: 20 pF; Voltage - Rated: 50V
C11 C18 = C0603X105M4RAC7867: CAP CER 0603 1UF 16V X7R 20%; manufacturer: KEMET; Part Number: C0603X105M4RAC7867; Capacitance: 1 µF; Applications: Boardflex Sensitive; componentlink1description: Datasheet; componentlink1url: https://api.kemet.com/component-edge/download/datasheet/C0603X105M4RAC7867.pdf; componentlink2description: DigiKey Link; componentlink2url: https://www.digikey.com/en/products/detail/kemet/C0603X105M4RAC7867/8635843; Device Package: 0603 (1608 Metric); Features: Soft Termination; lastupdated: 9.02.2024 20:10:28; Lifecycle Status: Active; Minimum Order: 1; Mounting Type: Surface Mount, MLCC; Operating Temperature: -55°C ~ 125°C; Package / Case: 0603 (1608 Metric); packaging: TapeAndReel; partid: 3937; Part Status: Active; price: 0.05; series: SMD Comm X7R Flex; Size / Dimension: 0.063" L x 0.031" W (1.60mm x 0.80mm); Supplier 1: DigiKey; Supplier Part Number 1: 399-17716-1-ND; Temperature Coefficient: X7R; Thickness (Max): 0.037" (0.95mm); Tolerance: ±20%; value: 1 µF; Voltage - Rated: 16V
C12 C14-C17 = C0805C104J1RECAUTO: as C7 on sheet Power; Part Number: C0805C104J1RECAUTO; Capacitance: 0.1 µF; Applications: Automotive, ESD Protection; componentlink1description: Datasheet; componentlink1url: https://api.kemet.com/component-edge/download/datasheet/C0805C104J1RECAUTO.pdf; componentlink2description: DigiKey Link; componentlink2url: https://www.digikey.com/en/products/detail/kemet/C0805C104J1RECAUTO/8646637; Device Package: 0805 (2012 Metric); lastupdated: 9.02.2024 20:15:06; Lifecycle Status: Active; Minimum Order: 1; Mounting Type: Surface Mount, MLCC; Operating Temperature: -55°C ~ 125°C; Package / Case: 0805 (2012 Metric); packaging: TapeAndReel; partid: 31979; Part Status: Active; price: 0.05; Ratings: AEC-Q200; series: ESD SMD Auto X7R; Size / Dimension: 0.079" L x 0.049" W (2.00mm x 1.25mm); Supplier 1: DigiKey; Supplier Part Number 1: 399-C0805C104J1RECAUTOCT-ND; Temperature Coefficient: X7R; Thickness (Max): 0.043" (1.10mm); Tolerance: ±5%; value: 0.1 µF; Voltage - Rated: 100V
D1 D2 = CMD17-21SRC/TR8: LED RED CLEAR 0805 SMD; Manufacturer: Visual Communications Company - VCC; Configuration: Standard; Current - Test: 20mA; Lens Color: Colorless; Lens Size: 1.40mm x 1.25mm; Lens Style: Rectangle with Flat Top; Millicandela Rating: 21mcd; Viewing Angle: 140°; Voltage - Forward (Vf) (Typ): 1.7V; Wavelength - Peak: 660nm; Part Number: CMD17-21SRC/TR8; Color: Red; ComponentLink1Description: Datasheet; ComponentLink1URL: https://vcclite.com/wp-content/uploads/wpallimport/files/files/CMD1721Seriesver3.pdf; ComponentLink2Description: DigiKey Link; ComponentLink2URL: https://www.digikey.com/en/products/detail/visual-communications-company-vcc/CMD17-21SRC-TR8/254848; Device Package: 0805 (2012 Metric); Height (Max): 1.20mm; LastUpdated: 3.06.2024 20:00:06; Lens Transparency: Clear; Lifecycle Status: Active; Minimum Order: 1; Mounting Type: Surface Mount; Package / Case: 0805 (2012 Metric); Packaging: TapeAndReel; PartId: 369; Part Status: Active; Price: 0.30; Series: CMD17-21; Size / Dimension: 2.00mm L x 1.25mm W; Supplier 1: DigiKey; Supplier Part Number 1: L62411CT-ND; Supplier Device Package: 0805
  D1: Value: Red
  D2: Value: Green
IC2 = STM32F103CBT6: IC MCU 32BIT 128KB FLASH 48LQFP; Manufacturer: STMicroelectronics; Connectivity: CANbus, I²C, IrDA, LINbus, SPI, UART/USART, USB; Core Processor: ARM® Cortex®-M3; Core Size: 32-Bit; Data Converters: A/D 10x12b; Number of I/O: 37; Oscillator Type: Internal; Peripherals: DMA, Motor Control PWM, PDR, POR, PVD, PWM, Temp Sensor, WDT; Program Memory Size: 128KB (128K x 8); RAM Size: 20K x 8; Speed: 72MHz; Voltage - Supply (Vcc/Vdd): 2V ~ 3.6V; Part Number: STM32F103CBT6; ComponentLink1Description: Datasheet; ComponentLink1URL: https://www.st.com/resource/en/datasheet/stm32f103cb.pdf; ComponentLink2Description: DigiKey Link; ComponentLink2URL: http://digikey.com/product-detail/en/stmicroelectronics/STM32F103CBT6/497-6288-ND/1754420; Device Package: 48-LQFP; LastUpdated: 24.05.2020 22:49:18; Lifecycle Status: Active; Minimum Order: 1; Mounting Type: Surface Mount; Operating Temperature: -40°C ~ 85°C (TA); Package / Case: 48-LQFP; Packaging: Tray; PartId: 194; Part Status: Active; Price: 5.25; Program Memory Type: FLASH; Series: STM32F1; Supplier 1: DigiKey; Supplier Part Number 1: 497-6288-ND
J4 J5 = 61300311121: CONN HEADER VERT 3POS 2.54MM; Manufacturer: Würth Elektronik; Contact Length - Mating: 0.236" (6.00mm); Contact Length - Post: 0.118" (3.00mm); Current Rating (Amps): 3A; Material Flammability Rating: UL94 V-0; Number of Positions: 3; Number of Positions Loaded: All; Overall Contact Length: 0.454" (11.54mm); Pitch - Mating: 0.100" (2.54mm); Row Spacing - Mating: -40°C ~ 105°C; Shrouding: Unshrouded; Style: Board to Board or Cable; Part Number: 61300311121; ComponentLink1Description: Datasheet; ComponentLink1URL: https://katalog.we-online.de/em/datasheet/6130xx11121.pdf; ComponentLink2Description: DigiKey Link; ComponentLink2URL: https://www.digikey.com/en/products/detail/würth-elektronik/61300311121/4846825; Connector Type: Header; Contact Finish - Mating: Gold; Contact Material: Copper Alloy; Contact Shape: Square; Contact Type: Male Pin; Fastening Type: Push-Pull; Insulation Color: Black; Insulation Height: 0.100" (2.54mm); Insulation Material: Polyamide (PA6T), Nylon 6T; LastUpdated: 18.10.2024 13:43:15; Lifecycle Status: Active; Minimum Order: 1; Mounting Type: Through Hole; Number of Rows: 1; Operating Temperature: -40°C ~ 105°C; Packaging: Bulk; PartId: 189; Part Status: Active; Price: 0.07; Series: WR-PHD; Supplier 1: DigiKey; Supplier Part Number 1: 732-5316-ND; Termination: Solder
J6 = SSW-106-03-T-S: CONN RCPT 6POS 0.1 TIN PCB; Manufacturer: Samtec Inc.; Connector Type: Receptacle; Contact Length - Post: 0.394" (10.00mm); Current Rating (Amps): 5.7A per Contact; Material Flammability Rating: UL94 V-0; Number of Positions: 6; Number of Positions Loaded: All; Pitch - Mating: 0.100" (2.54mm); Style: Board to Board or Cable; Part Number: SSW-106-03-T-S; ComponentLink1Description: Datasheet; ComponentLink1URL: http://suddendocs.samtec.com/prints/ssw-s.pdf; ComponentLink2Description: DigiKey Link; ComponentLink2URL: https://www.digikey.com/en/products/detail/samtec-inc/SSW-106-03-T-S/1790202; Contact Finish - Mating: Tin; Contact Finish - Post: Tin; Contact Type: Forked; Fastening Type: Push-Pull; Insulation Color: Black; Insulation Height: 0.335" (8.51mm); LastUpdated: 21.06.2022 15:09:22; Lifecycle Status: Active; Minimum Order: 1; Mounting Type: Through Hole; Number of Rows: 1; Operating Temperature: -55°C ~ 105°C; Packaging: Bulk; Part Status: Active; Price: 0.55; Series: SSW; Supplier 1: DigiKey; Supplier Part Number 1: SAM8865-ND; Termination: Solder
R3 R6 R7 = RK73B1JTTDD391J: RESISTOR; Manufacturer: KOA Speer Electronics, Inc.; Power (Watts): 0.125W, 1/8W; Temperature Coefficient: ±200ppm/°C; Tolerance: ±5%; Part Number: RK73B1JTTDD391J; Value: 390 Ohms; ComponentLink1Description: Datasheet; ComponentLink1URL: https://www.koaspeer.com/pdfs/RK73B.pdf; ComponentLink2Description: DigiKey Link; ComponentLink2URL: https://www.digikey.com/en/products/detail/koa-speer-electronics-inc/RK73B1JTTDD391J/21679924; Composition: Thick Film; Device Package: 0603 (1608 Metric); Features: Automotive AEC-Q200; Height - Seated (Max): 0.022" (0.55mm); LastUpdated: 25.07.2024 09:42:51; Lifecycle Status: Active; Minimum Order: 1; Number of Terminations: 2; Operating Temperature: -55°C ~ 155°C; Package / Case: 0603 (1608 Metric); Packaging: CutTape; PartId: 89761; Price: 0.01; Ratings: AEC-Q200; Resistance: 390 Ohms; Series: RK73B; Size / Dimension: 0.063" L x 0.031" W (1.60mm x 0.80mm); Supplier 1: DigiKey; Supplier Part Number 1: 2019-RK73B1JTTDD391JCT-ND; Supplier Device Package: 0603
R4 R5 = AT0603FRE0710KL: RES SMD 10K OHM 1% 1/10W 0603; Manufacturer: Yageo; Power (Watts): 0.1W, 1/10W; Temperature Coefficient: ±50ppm/°C; Part Number: AT0603FRE0710KL; Value: 10 kOhms; ComponentLink1Description: Datasheet; ComponentLink1URL: http://www.yageo.com/documents/recent/PYu-AT_51_RoHS_L_5.pdf; ComponentLink2Description: DigiKey Link; ComponentLink2URL: https://www.digikey.com/en/products/detail/yageo/AT0603FRE0710KL/5138641; Composition: Thin Film; Device Package: 0603 (1608 Metric); Features: Anti-Sulfur, Automotive AEC-Q200, Moisture Resistant; Height - Seated (Max): 0.022" (0.55mm); LastUpdated: 25.07.2024 09:19:22; Lifecycle Status: Active; Minimum Order: 1; Number of Terminations: 2; Operating Temperature: -55°C ~ 155°C; Package / Case: 0603 (1608 Metric); Packaging: TapeAndReel; PartId: 18757; Part Status: Active; Price: 0.02; Ratings: AEC-Q200; Resistance: 10 kOhms; Series: AT; Size / Dimension: 0.063" L x 0.031" W (1.60mm x 0.80mm); Supplier 1: DigiKey; Supplier Part Number 1: YAG2122CT-ND; Supplier Device Package: 0603; Tolerance: ±1%
S1 = PTS645SM43SMTR92 LFS: SWITCH TACTILE SPST-NO 0.05A 12V; Manufacturer: C&K; Actuator Height off PCB, Vertical: 4.30mm; Actuator Orientation: Top Actuated; Actuator Type: Standard; Contact Rating @ Voltage: 0.05A @ 12VDC; Illumination: Non-Illuminated; Operating Force: 160gf; Outline: 6.00mm x 6.00mm; Switch Function: Off-Mom; Part Number: PTS645SM43SMTR92 LFS; Circuit: SPST-NO; ComponentLink1Description: Datasheet; ComponentLink1URL: https://dznh3ojzb2azq.cloudfront.net/products/Tactile/PTS645/documents/datasheet.pdf; ComponentLink2Description: DigiKey Link; ComponentLink2URL: http://digikey.com/product-detail/en/c-k/PTS645SM43SMTR92-LFS/CKN9112CT-ND/1146934; Features: Blue Actuator; LastUpdated: 9.04.2020 09:59:00; Lifecycle Status: Active; Minimum Order: 1; Mounting Type: Surface Mount; Operating Temperature: -20°C ~ 60°C; Packaging: TapeAndReel; Part Status: Active; Price: 0.09; Series: PTS645; Supplier 1: DigiKey; Supplier Part Number 1: CKN9112CT-ND; Termination Style: Gull Wing
Y1 = NX5032GA-8MHZ-EXS00A-CG07039: CRYSTAL 8.0000MHZ 18PF SMD; Manufacturer: NDK America, Inc.; ESR (Equivalent Series Resistance): 300 Ohms; Frequency Stability: ±30ppm; Frequency Tolerance: ±20ppm; Operating Mode: Fundamental; Part Number: NX5032GA-8MHZ-EXS00A-CG07039; ComponentLink1Description: Datasheet; ComponentLink1URL: //media.digikey.com/pdf/Data%20Sheets/NDK%20PDFs/NX5032GA-8MHz-EXS00A-CG07039.pdf; ComponentLink2Description: DigiKey Link; ComponentLink2URL: https://www.digikey.com/en/products/detail/ndk-america-inc/NX5032GA-8MHZ-EXS00A-CG07039/8275423; Frequency: 8 MHz; Height - Seated (Max): 0.059" (1.50mm); LastUpdated: 3.06.2024 20:02:22; Lifecycle Status: Active; Load Capacitance: 18pF; Minimum Order: 1; Mounting Type: Surface Mount; Operating Temperature: -40°C ~ 85°C; Package / Case: 2-SMD, No Lead; Packaging: TapeAndReel; PartId: 609; Part Status: Active; Price: 0.32; Series: NX5032GA; Size / Dimension: 0.197" L x 0.126" W (5.00mm x 3.20mm); Supplier 1: DigiKey; Supplier Part Number 1: 644-1318-1-ND; Type: MHz Crystal; Value: 8 MHz

## Nets that join several sheets
+3.3: Power (C8.2 C9.2 IC1.2 IC1.4), Mcu (17 pins)
GND: Power (13 pins), Mcu (19 pins)
PA1: Power (J2.1), Mcu (IC2.11)
PA2: Power (J2.2), Mcu (IC2.12)
PA3: Power (J2.3), Mcu (IC2.13)
PA4: Power (J2.4), Mcu (IC2.14)
PA5: Power (J2.5), Mcu (IC2.15)
PA6: Power (J2.6), Mcu (IC2.16)
PA7: Power (J2.7), Mcu (IC2.17)
PA8: Power (J3.1), Mcu (IC2.29)
PA9: Power (J3.2), Mcu (IC2.30)
PA10: Power (J3.3), Mcu (IC2.31)
PA11: Power (J3.4), Mcu (IC2.32)
PA12: Power (J3.5), Mcu (IC2.33)
PA15: Power (J3.6), Mcu (IC2.38)
PC13: Power (J3.7), Mcu (IC2.2)